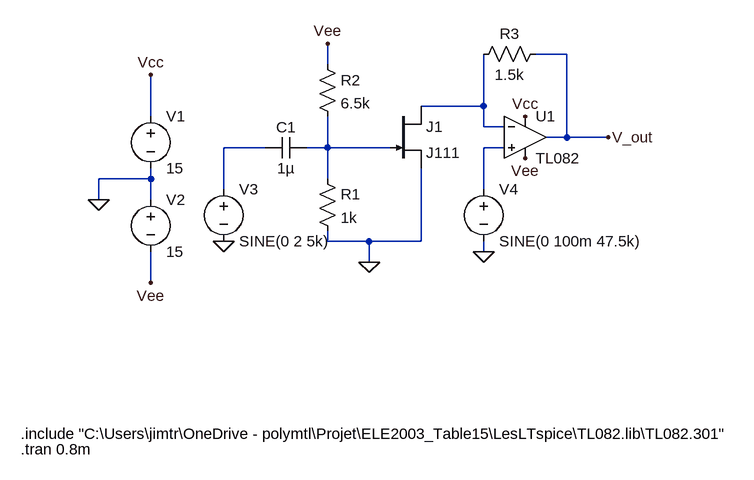
[diagram p0: schematic Mon_modulateur.asc]
Mon_modulateur.asc, the LTspice schematic file:
Version 4.1
SHEET 1 1376 680
WIRE 992 -80 944 -80
WIRE 624 -64 624 -96
WIRE 864 0 864 -80
WIRE 864 0 768 0
WIRE 352 16 352 -48
WIRE 864 32 864 0
WIRE 896 32 864 32
WIRE 992 48 992 -80
WIRE 992 48 960 48
WIRE 1056 48 992 48
WIRE 528 64 464 64
WIRE 624 64 624 16
WIRE 624 64 592 64
WIRE 720 64 624 64
WIRE 896 64 864 64
WIRE 352 112 352 96
WIRE 352 112 272 112
WIRE 624 112 624 64
WIRE 464 128 464 64
WIRE 864 128 864 64
WIRE 272 144 272 112
WIRE 352 144 352 112
WIRE 624 208 624 192
WIRE 688 208 624 208
WIRE 768 208 768 96
WIRE 768 208 688 208
WIRE 864 224 864 208
WIRE 688 240 688 208
WIRE 352 272 352 224
FLAG 272 144 0
FLAG 352 272 Vee
FLAG 352 -48 Vcc
FLAG 464 208 0
FLAG 688 240 0
FLAG 624 -96 Vee
FLAG 864 224 0
FLAG 928 80 Vee
FLAG 928 16 Vcc
FLAG 1056 48 V_out
SYMBOL voltage 352 0 R0
WINDOW 123 0 0 Left 0
WINDOW 39 0 0 Left 0
SYMATTR InstName V1
SYMATTR Value 15
SYMBOL voltage 352 128 R0
WINDOW 123 0 0 Left 0
WINDOW 39 0 0 Left 0
SYMATTR InstName V2
SYMATTR Value 15
SYMBOL voltage 464 112 R0
WINDOW 123 0 0 Left 0
WINDOW 39 0 0 Left 0
SYMATTR InstName V3
SYMATTR Value SINE(0 2 5k)
SYMBOL cap 592 48 R90
WINDOW 0 0 32 VBottom 2
WINDOW 3 32 32 VTop 2
SYMATTR InstName C1
SYMATTR Value 1µ
SYMBOL res 608 96 R0
SYMATTR InstName R1
SYMATTR Value 1k
SYMBOL res 608 -80 R0
SYMATTR InstName R2
SYMATTR Value 6.5k
SYMBOL voltage 864 112 R0
WINDOW 123 0 0 Left 0
WINDOW 39 0 0 Left 0
SYMATTR InstName V4
SYMATTR Value SINE(0 100m 47.5k)
SYMBOL OpAmps\\opamp2 928 -16 R0
SYMATTR InstName U1
SYMATTR Value TL082
SYMBOL res 960 -96 R90
WINDOW 0 0 56 VBottom 2
WINDOW 3 32 56 VTop 2
SYMATTR InstName R3
SYMATTR Value 1.5k
SYMBOL njf 720 0 R0
SYMATTR InstName J1
SYMATTR Value J111
TEXT 152 504 Left 2 !.include "C:\\Users\\jimtr\\OneDrive - polymtl\\Projet\\ELE2003_Table15\\LesLTspice\\TL082.lib\\TL082.301"
TEXT 152 528 Left 2 !.tran 0.8m

The netlist it stands for:
* Mon_modulateur.asc
V1 Vcc 0 15
V2 0 Vee 15
V3 N002 0 SINE(0 2 5k)
C1 N003 N002 1µ
R1 N003 0 1k
R2 Vee N003 6.5k
V4 N004 0 SINE(0 100m 47.5k)
X§U1 N004 N001 Vcc Vee V_out TL082  ; pins In+ In- V+ V- OUT
R3 V_out N001 1.5k
J1 N001 N003 0 J111
.model NJF NJF
.model PJF PJF
.lib standard.jft
.include "C:\Users\jimtr\OneDrive - polymtl\Projet\ELE2003_Table15\LesLTspice\TL082.lib\TL082.301"
.tran 0.8m
.backanno
.end